# EAGLE schematic Macropad (EAGLE 9.2.1)
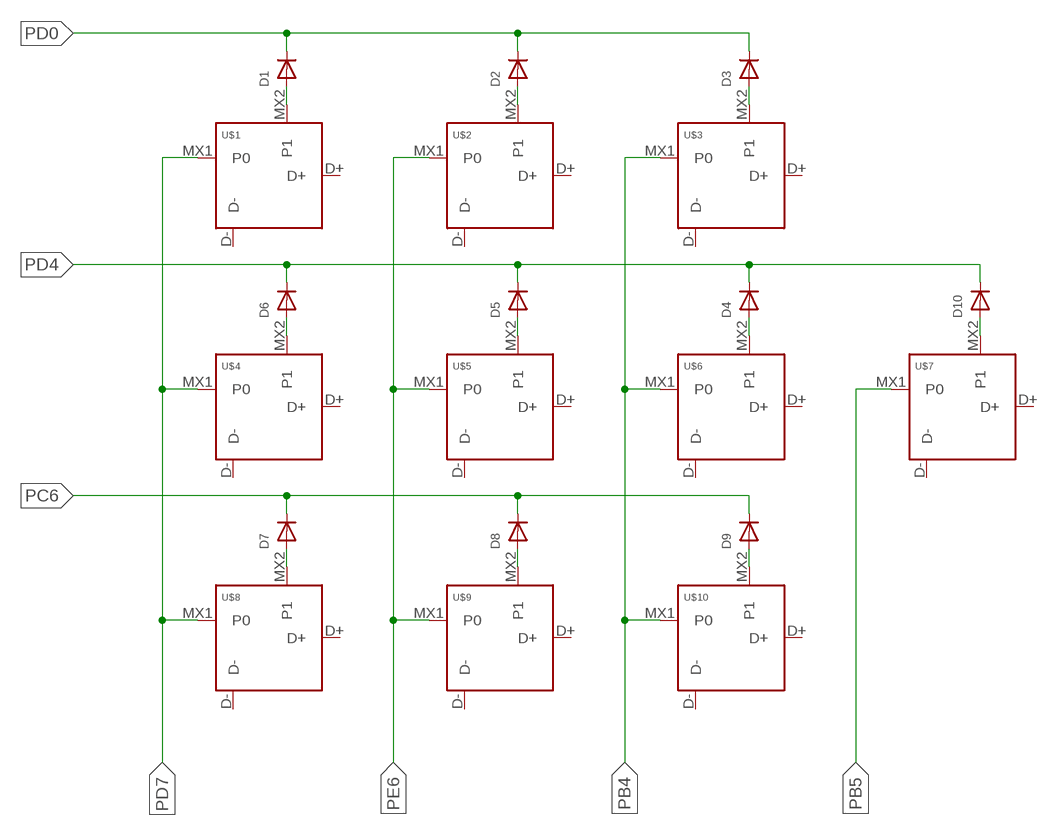
[diagram p0: schematic, sheet 1]

## Parts
D1  DIODEDO-1N4148  [DO-1N4148]
D2  DIODEDO-1N4148  [DO-1N4148]
D3  DIODEDO-1N4148  [DO-1N4148]
D4  DIODEDO-1N4148  [DO-1N4148]
D5  DIODEDO-1N4148  [DO-1N4148]
D6  DIODEDO-1N4148  [DO-1N4148]
D7  DIODEDO-1N4148  [DO-1N4148]
D8  DIODEDO-1N4148  [DO-1N4148]
D9  DIODEDO-1N4148  [DO-1N4148]
D10  DIODEDO-1N4148  [DO-1N4148]
U$1  KEYSWITCH-DIODE-MX-1U-DIODE  [MX-1U-DIODE]
U$2  KEYSWITCH-DIODE-MX-1U-DIODE  [MX-1U-DIODE]
U$3  KEYSWITCH-DIODE-MX-1U-DIODE  [MX-1U-DIODE]
U$4  KEYSWITCH-DIODE-MX-1U-DIODE  [MX-1U-DIODE]
U$5  KEYSWITCH-DIODE-MX-1U-DIODE  [MX-1U-DIODE]
U$6  KEYSWITCH-DIODE-MX-1U-DIODE  [MX-1U-DIODE]
U$7  KEYSWITCH-DIODE-MX-1U-DIODE  [MX-1U-DIODE]
U$8  KEYSWITCH-DIODE-MX-1U-DIODE  [MX-1U-DIODE]
U$9  KEYSWITCH-DIODE-MX-1U-DIODE  [MX-1U-DIODE]
U$10  KEYSWITCH-DIODE-MX-1U-DIODE  [MX-1U-DIODE]

## Nets
N$3: D10.A U$7.MX2(P1)
N$4: D4.A U$6.MX2(P1)
N$5: D9.A U$10.MX2(P1)
N$8: D8.A U$9.MX2(P1)
N$9: D7.A U$8.MX2(P1)
N$10: D6.A U$4.MX2(P1)
N$11: D1.A U$1.MX2(P1)
N$12: D2.A U$2.MX2(P1)
N$13: D3.A U$3.MX2(P1)
N$15: D5.A U$5.MX2(P1)
PB4: U$3.MX1(P0) U$6.MX1(P0) U$10.MX1(P0)
PB5: U$7.MX1(P0)
PC6: D7.C D8.C D9.C
PD0: D1.C D2.C D3.C
PD4: D4.C D5.C D6.C D10.C
PD7: U$1.MX1(P0) U$4.MX1(P0) U$8.MX1(P0)
PE6: U$2.MX1(P0) U$5.MX1(P0) U$9.MX1(P0)
Unconnected: U$1.D+ U$1.D- U$2.D+ U$2.D- U$3.D+ U$3.D- U$4.D+ U$4.D- U$5.D+ U$5.D- U$6.D+ U$6.D- U$7.D+ U$7.D- U$8.D+ U$8.D- U$9.D+ U$9.D- U$10.D+ U$10.D-

## Library data of the parts
D1-D10 = adafruit:DIODE: Diode SMADIODE - SMA Surface Mount Package 20V 1A Schottky Diode Digikey: 641-1014-6-ND DO-1N4148 - Through Hole Small Current Diode SOD-123 20V 1 A (.5mV Vf) Schottky Diode - Digikey: MBRX120TPMSCT-ND SOD-323 10V 570mA (.38mV Vf, 3ns) Schottky Diode - Digikey: ZLLS410CT-ND SOD-523 30V 30mA Schottky Diode (RB751S-40TE61) - Digikey: RB751S-40TE61CT-ND SOT23-R/W - SOT23 Package (R = Solder Paste/Reflow Ovens, W = Hand-Soldering) BAT54Film 40V 300mA - Digikey: 497-7162-1-ND
U$1-U$10 = Keyboard:KEYSWITCH-DIODE